# EAGLE design working (EAGLE 6.4)
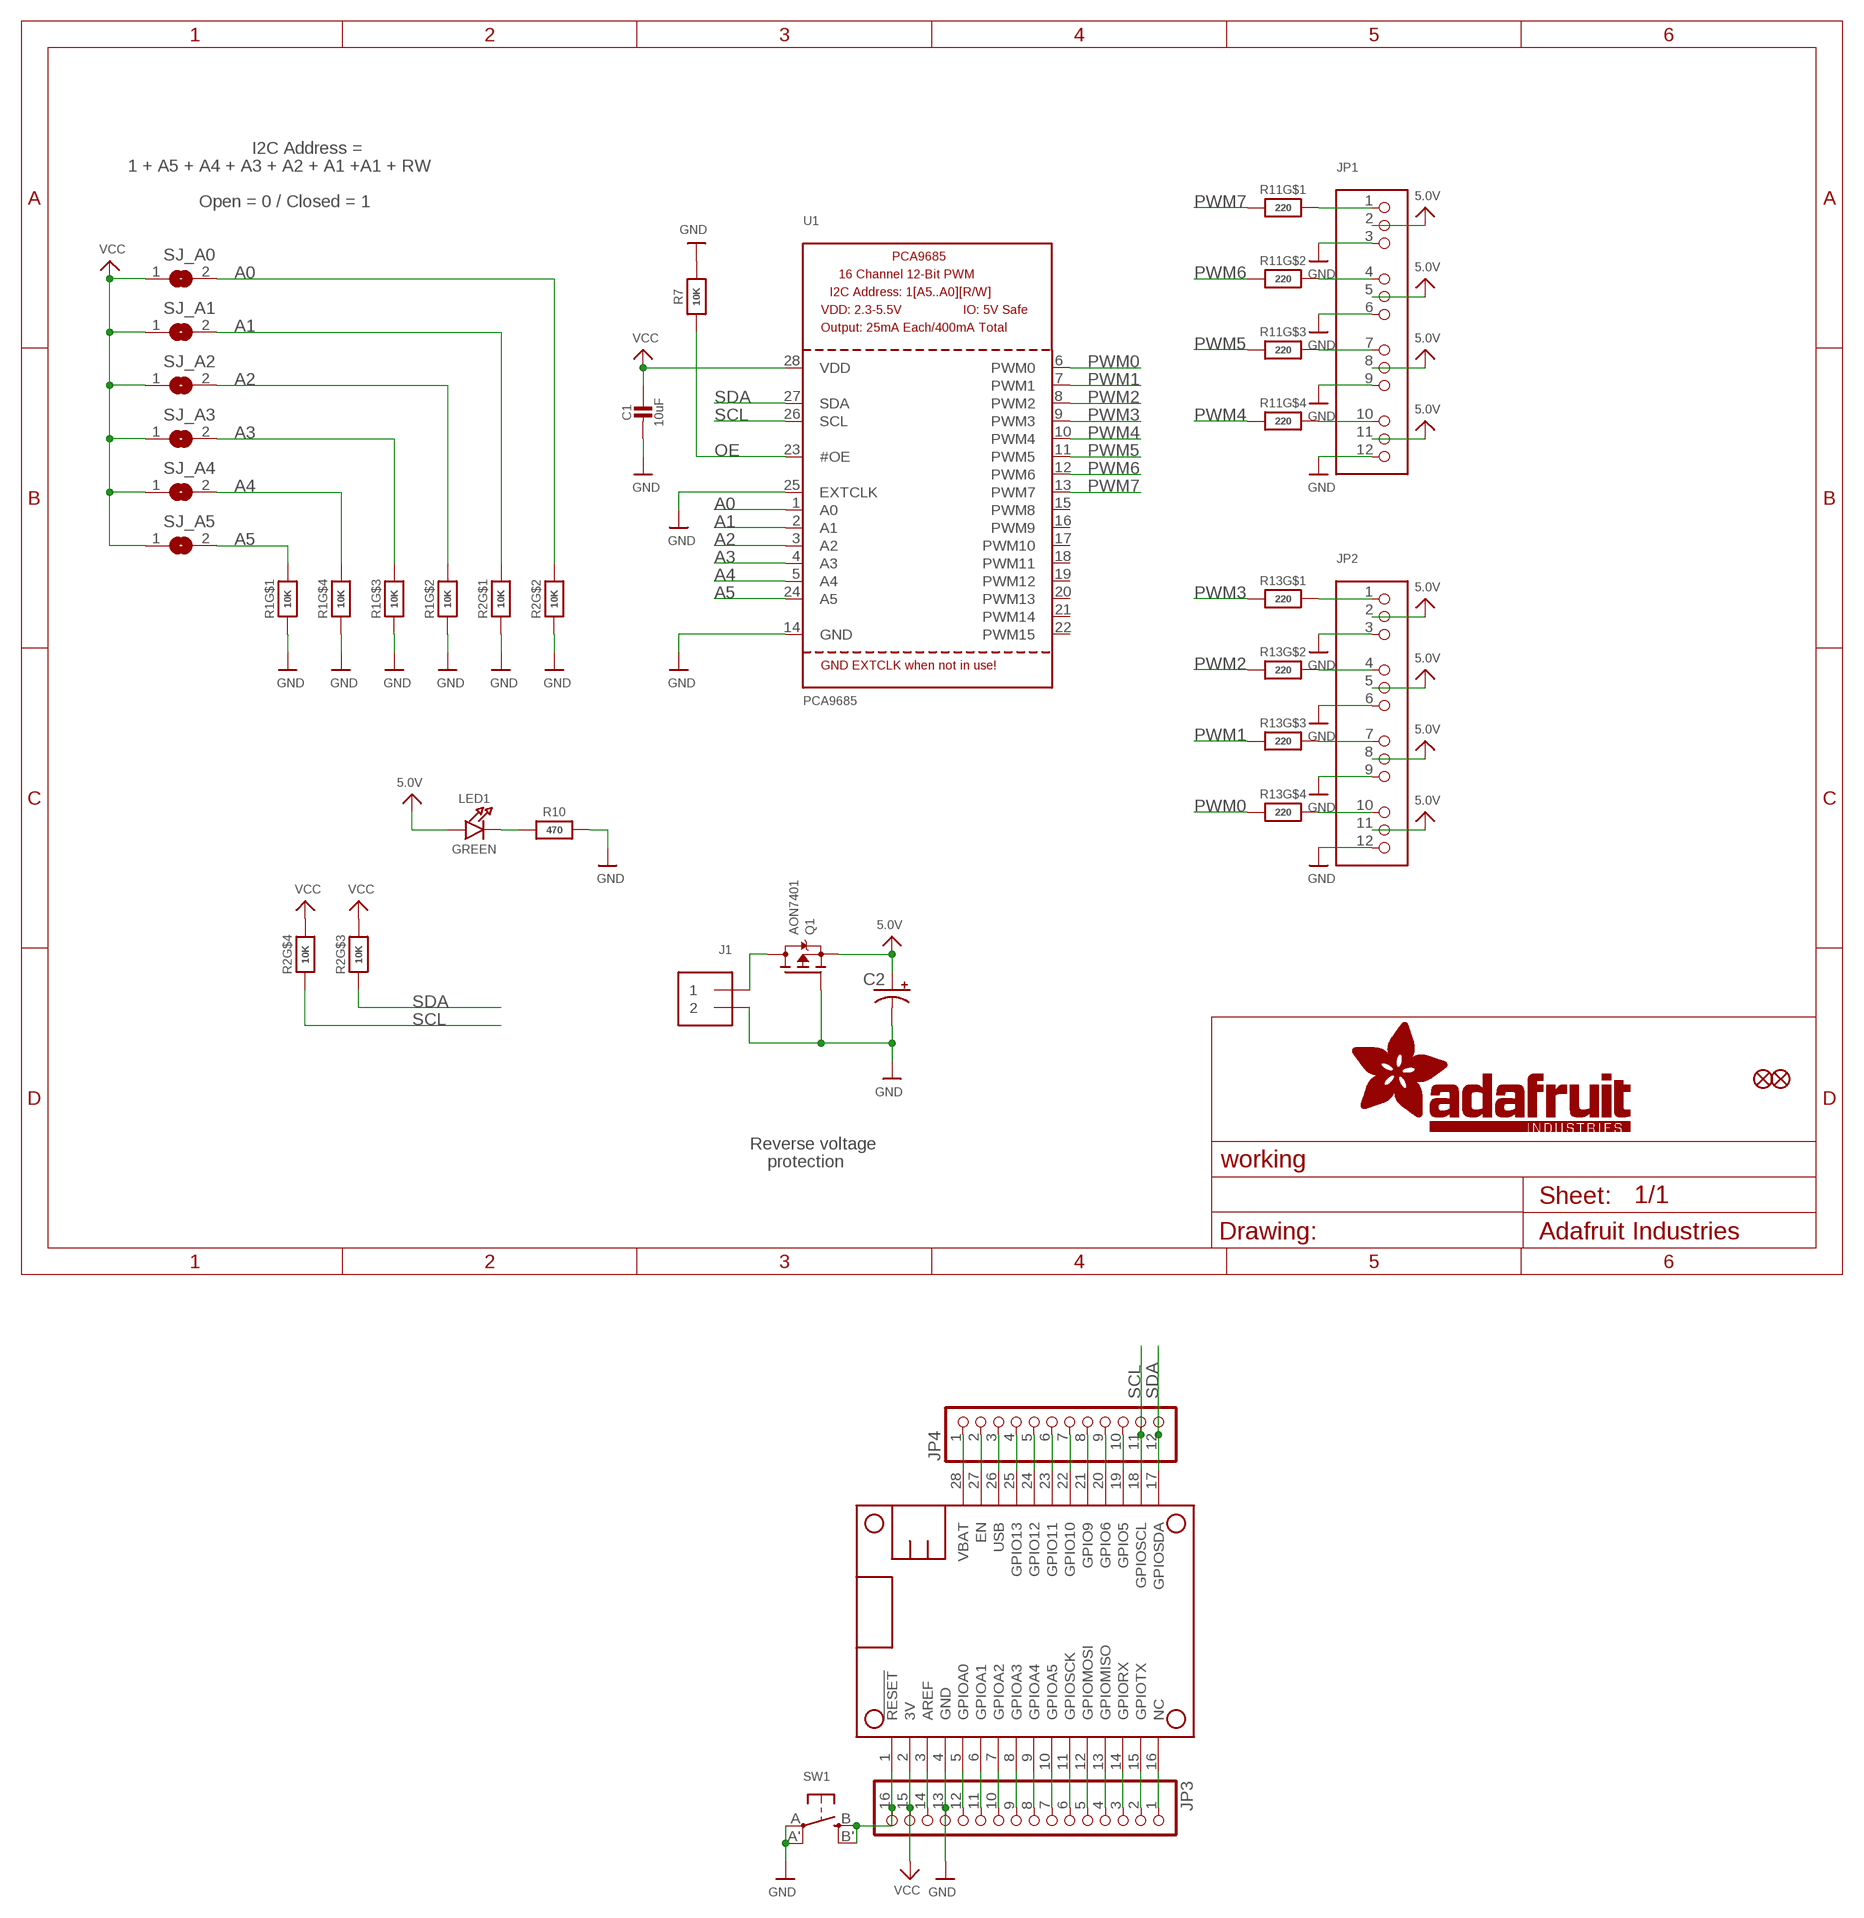
[diagram p0: schematic, sheet 1]

## Parts
C1  10uF  CAP_CERAMIC0805-NOOUTLINE  [0805-NO]
C2  CPOL-USE3.5-8  [E3,5-8]
FID1  FIDUCIAL""  [FIDUCIAL_1MM]
FID2  FIDUCIAL""  [FIDUCIAL_1MM]
J1  TERMBLOCK_1X2  [TERMBLOCK_1X2-3.5MM]
JP1  HEADER-3X04  [3X04]
JP2  HEADER-3X04  [3X04]
JP3  HEADER-1X16ROUND  [1X16_ROUND]
JP4  HEADER-1X12  [1X12_ROUND]
LED1  GREEN  LED0805_NOOUTLINE  [CHIPLED_0805_NOOUTLINE]
MS1  FEATHERWING  [FEATHERWING]
Q1  AON7401  MOSFET-P-POWERDI3333  [POWERDI3333]
R1  10K  RESISTOR_4PACK  [RESPACK_4X0603]
R2  10K  RESISTOR_4PACK  [RESPACK_4X0603]
R7  10K  RESISTOR0805_NOOUTLINE  [0805-NO]
R10  470  RESISTOR0805_NOOUTLINE  [0805-NO]
R11  220  RESISTOR_4PACK  [RESPACK_4X0603]
R13  220  RESISTOR_4PACK  [RESPACK_4X0603]
SJ_A0  SOLDERJUMPERREFLOW_NOPASTE  [SOLDERJUMPER_REFLOW_NOPASTE]
SJ_A1  SOLDERJUMPERREFLOW_NOPASTE  [SOLDERJUMPER_REFLOW_NOPASTE]
SJ_A2  SOLDERJUMPERREFLOW_NOPASTE  [SOLDERJUMPER_REFLOW_NOPASTE]
SJ_A3  SOLDERJUMPERREFLOW_NOPASTE  [SOLDERJUMPER_REFLOW_NOPASTE]
SJ_A4  SOLDERJUMPERREFLOW_NOPASTE  [SOLDERJUMPER_REFLOW_NOPASTE]
SJ_A5  SOLDERJUMPERREFLOW_NOPASTE  [SOLDERJUMPER_REFLOW_NOPASTE]
SW1  SWITCH_TACT_SMT4.6X2.8  [BTN_KMR2_4.6X2.8]
U1  PCA9685  [TSSOP28]

## Nets
5.0V: C2.+ JP1.2 JP1.5 JP1.8 JP1.11 JP2.2 JP2.5 JP2.8 JP2.11 LED1.A Q1.1(S) Q1.2(S) Q1.3(S)
A0: R2.7 SJ_A0.2 U1.1(A0)
A1: R2.8 SJ_A1.2 U1.2(A1)
A2: R1.7 SJ_A2.2 U1.3(A2)
A3: R1.6 SJ_A3.2 U1.4(A3)
A4: R1.5 SJ_A4.2 U1.5(A4)
A5: R1.8 SJ_A5.2 U1.24(A5)
GND: C1.2 C2.- J1.2 JP1.3 JP1.6 JP1.9 JP1.12 JP2.3 JP2.6 JP2.9 JP2.12 JP3.13 MS1.4(GND) Q1.4(G) R1.1 R1.2 R1.3 R1.4 R2.1 R2.2 R7.2 R10.2 SW1.A'(P1) SW1.A(P) U1.14(GND) U1.25(EXTCLK)
N$1: LED1.C R10.1
N$2: JP1.4 R11.7
N$3: JP1.1 R11.8
N$4: JP1.7 R11.6
N$5: JP1.10 R11.5
N$6: JP2.1 R13.8
N$7: JP2.4 R13.7
N$8: JP2.7 R13.6
N$9: JP2.10 R13.5
N$10: JP3.1 MS1.16(NC)
N$11: JP3.2 MS1.15(GPIOTX)
N$12: JP3.3 MS1.14(GPIORX)
N$13: JP3.4 MS1.13(GPIOMISO)
N$14: JP3.5 MS1.12(GPIOMOSI)
N$15: JP3.6 MS1.11(GPIOSCK)
N$16: JP3.7 MS1.10(GPIOA5)
N$17: JP3.8 MS1.9(GPIOA4)
N$18: JP3.9 MS1.8(GPIOA3)
N$19: JP3.10 MS1.7(GPIOA2)
N$20: JP3.11 MS1.6(GPIOA1)
N$21: JP3.12 MS1.5(GPIOA0)
N$22: JP3.14 MS1.3(AREF)
N$24: JP4.2 MS1.27(EN)
N$25: JP4.4 MS1.25(GPIO13)
N$26: JP4.5 MS1.24(GPIO12)
N$27: JP4.6 MS1.23(GPIO11)
N$28: JP4.7 MS1.22(GPIO10)
N$29: JP4.8 MS1.21(GPIO9)
N$30: JP4.9 MS1.20(GPIO6)
N$31: JP4.10 MS1.19(GPIO5)
N$32: JP3.16 MS1.1(!RESET) SW1.B'(S1) SW1.B(S)
OE: R7.1 U1.23(#OE)
PWM0: R13.4 U1.6(PWM0)
PWM1: R13.3 U1.7(PWM1)
PWM2: R13.2 U1.8(PWM2)
PWM3: R13.1 U1.9(PWM3)
PWM4: R11.4 U1.10(PWM4)
PWM5: R11.3 U1.11(PWM5)
PWM6: R11.2 U1.12(PWM6)
PWM7: R11.1 U1.13(PWM7)
PWRIN: J1.1 Q1.5678(D)
SCL: JP4.11 MS1.18(GPIOSCL) R2.4 U1.26(SCL)
SDA: JP4.12 MS1.17(GPIOSDA) R2.3 U1.27(SDA)
USB: JP4.3 MS1.26(USB)
VBAT: JP4.1 MS1.28(VBAT)
VCC: C1.1 JP3.15 MS1.2(3V) R2.5 R2.6 SJ_A0.1 SJ_A1.1 SJ_A2.1 SJ_A3.1 SJ_A4.1 SJ_A5.1 U1.28(VDD)
Unconnected: U1.15(PWM8) U1.16(PWM9) U1.17(PWM10) U1.18(PWM11) U1.19(PWM12) U1.20(PWM13) U1.21(PWM14) U1.22(PWM15)

## Notes on the sheet
- I2C Address =
- 1 + A5 + A4 + A3 + A2 + A1 +A1 + RW
- Open = 0 / Closed = 1
- Reverse voltage
- protection

## Library data of the parts
C1 = microbuilder:CAP_CERAMIC: Ceramic Capacitors For new designs, use the packages preceded by an '_' character since they are more reliable: The following footprints should be used on most boards: _0402 - Standard footprint for regular board layouts _0603 - Standard footprint for regular board layouts _0805 - Standard footprint for regular board layouts _1206 - Standard footprint for regular board layouts For extremely tight-pitch boards where space is at a premium, the following 'micro-pitch' footprints can be used (smaller pads, no silkscreen outline, etc.): _0402MP - Micro-pitch footprint for very dense/compact boards _0603MP - Micro-pitch footprint for very dense/compact boards _0805MP - Micro-pitch footprint for very dense/compact boards _1206MP - Micro-pitch footprint for very dense/compact boards
C2 = adafruit:CPOL-US: POLARIZED CAPACITOR, American symbol
FID1 FID2 = microbuilder:FIDUCIAL: Fiducial Alignment Points Various fiducial points for machine vision alignment.; BOM: EXCLUDE
J1 = microbuilder:TERMBLOCK_1X2: 3.5mm Terminal block http://www.ladyada.net/library/pcb/eaglelibrary.html
JP1 JP2 = microbuilder:HEADER-3X04
JP3 = microbuilder:HEADER-1X16: PIN HEADER
JP4 = microbuilder:HEADER-1X12
LED1 = microbuilder:LED: LED 0603 - 0603 Surface Mount Package 2mA: Green LED - Low Power (3.9mcd, 2ma, 1.7Vf) - Digikey: 475-2709-2-ND Orange LED - Low Power (9.8mcd, 2ma, 1.8Vf) - Digikey: 475-1194-2-ND Red LED - Low Power (5mcd, 2ma, 1.8Vf) - Digikey: 475-1195-2-ND Yellow LED - Low Power (7mcd, 2ma, 1.8Vf) - Digikey: 475-1196-2-ND 5mA: Blue LED - Low Power (17mcd, 5ma, 2.9Vf) - Digikey: LNJ937W8CRACT-ND 0805 - 0805 Surface Mount Package 2mA: Red LED (8.8mcd, 2mA, 1.8Vf, Clear) - Low Power [Digikey: 475-2510-1-ND] Green LED (5mcd, 2mA, 1.8Vf, Clear) - Low Power [Digikey: 475-2730-1-ND] Yellow LED (11.3mcd, 2mA, 1.8Vf, Clear) - Low Power [Digikey: 475-2555-1-ND] 20mA: Red LED (104mcd, 20mA, Diffused) - LS R976 [Digikey: 475-1278-6-ND] Red LED (12mcd, 20mA, 2.0Vf, Clear) - APT2012EC [Digikey: 754-1128-1-ND] Green LED (15mcd, 20mA, 2.2Vf, Clear) - APT2012GC [Digikey: 754-1131-1-ND] Orange LED (160mcd, 20mA, 2.1Vf, Clear) - APT2012SECK [Digikey: 754-1130-1-ND] 1206 - 1206 Surface Mount Package Green LED (26mcd, 20mA, Diffused) - LG N971 [Digikey: 475-1407-6-ND] Red LED (15mcd, 20mA, Diffused) - LH N974 [Digikey: 475-1416-6-ND] Cree - Cree High-Power Surface Mount LEDs XPEBWT-L1-0000-00D50 - White 111lm 350mA 2.9Vf 6200K 110° XTEAWT-00-0000-00000LEE3 - White 114lm 350mA 2.85Vf 5000K 115° Everlight - Everlight 45-21 Series Surface Mount LEDs 45-21/QK2C-B2832AC2CB2/2T - Warm White 2000mcd 20mA 3.25Vf 3050K 120° 45-21/LK2C-B38452C4CB2/2T - Nuetral White 2000mcd 20mA 3.25Vf 4150K 120° 45-21/LK2C-B50634C6CB2/2T - Cold White 2200mcd 20mA 3.25Vf 5650K 120° PLCC2 Reverse Mount LS T77K-J1L2-1-0-2-R18-Z - Red 11.25mcd 2mA 1.8Vf 630nm 120° LO T77K-L1M2-24-Z - Orange 19.6mcd 2mA 1.8Vf 606nm 120° LY T77K-K2M1-26-Z - Yellow 15.7mcd 2mA 1.8Vf 587nm 120°
MS1 = microbuilder:FEATHERWING
Q1 = microbuilder:MOSFET-P: P-Channel Mosfet LEGEND VDS: Voltage Drain-Source ID: Drain Current RDS(ON): Drain-Source On-State Resistance VGS(TH): Gate-Source Threshold Voltage CISS: Drain-Source Input Capacitance SOT-23 Name VDS ID RDS(ON) VGS(TH) CISS Order Number IRLML5103 30V 760mA 600 mOhm -- 75pF @ 25V Digikey: IRLML5103PBFCT-ND IRLML6401 12V 4.3A 50 mOhm 950mV @ 250µA 830pF @ 10V Digikey: IRLML6401PBFTR-ND NTR0202PL 20V 400mA 800 mOhm 2.3V @ 250uA 70pF @ 5V Digikey: NTR0202PLT1GOSTR-ND NTR4101PT1G 20V 1.8A 85 mOhm 1.2V @ 250uA 675pF @ 10V Digikey: NTR4101PT1GOSCT-ND DMP2004K 20V 600mA 900 mOhm 1V @ 250uA 175pF @ 16V Digikey: DMP2004KDICT-ND PMV65XP 20V 3.9A 76 mOhm 950mV @ 1mA 725pF @ 20V Digikey: 568-2358-2-ND TO-252 Name VDS ID RDS(ON) VGS(TH) CISS Order Number AOD417 30V 25A 34 mOhm 3V @ 250µA 920pF @ 15V Digikey: 785-1106-2-ND
R1 R2 R11 R13 = microbuilder:RESISTOR_4PACK: Resistor Packs (4 resistors) 4 x 0603 10K 1/16W - Digikey: YC164J-10KCT-ND
R7 R10 = microbuilder:RESISTOR: Resistors For new designs, use the packages preceded by an '_' character since they are more reliable: The following footprints should be used on most boards: _0402 - Standard footprint for regular board layouts _0603 - Standard footprint for regular board layouts _0805 - Standard footprint for regular board layouts _1206 - Standard footprint for regular board layouts For extremely tight-pitch boards where space is at a premium, the following 'micro-pitch' footprints can be used (smaller pads, no silkscreen outline, etc.): _0402MP - Micro-pitch footprint for very dense/compact boards _0603MP - Micro-pitch footprint for very dense/compact boards _0805MP - Micro-pitch footprint for very dense/compact boards _1206MP - Micro-pitch footprint for very dense/compact boards
SJ_A0 SJ_A1-SJ_A5 = microbuilder:SOLDERJUMPER: SMD Solder JUMPER Solder the two pads together to create a connection, or remove the solder to break it. REFLOW - Use this footprint for solder paste and reflow ovens. WAVE - Use this footprint for hand-soldering (larger pads). CLOSED - Has a trace between the two pads to ensure it is closed by default. The trace needs to be cut to disable the jumper, and can be closed again by creating a solder bridge between the two pads.
SW1 = microbuilder:SWITCH_TACT_SMT: SMT Tact Switches 6x6mm - Digikey: P12940SCT-ND KMR2 (4.6x2.8mm) - Digikey: 401-1426-1-ND EVQ-PQHB55 - Light Touch, 160GF (4.5x4.5mm) - Digikey: P8090SCT-ND KMT0 - KMT021 NGJ LHS (etc.) IP68/Waterproof - Digikey: CKN10289CT-ND
U1 = microbuilder:PCA9685: PCA9685 - 16 Channel 12-Bit I2C PWM Controller 5.0V tolerant 16 channel, 12-bit I2C PWM controller with 25mA per output (max. 400mA total) Digikey: 568-5931-1-ND

## Board
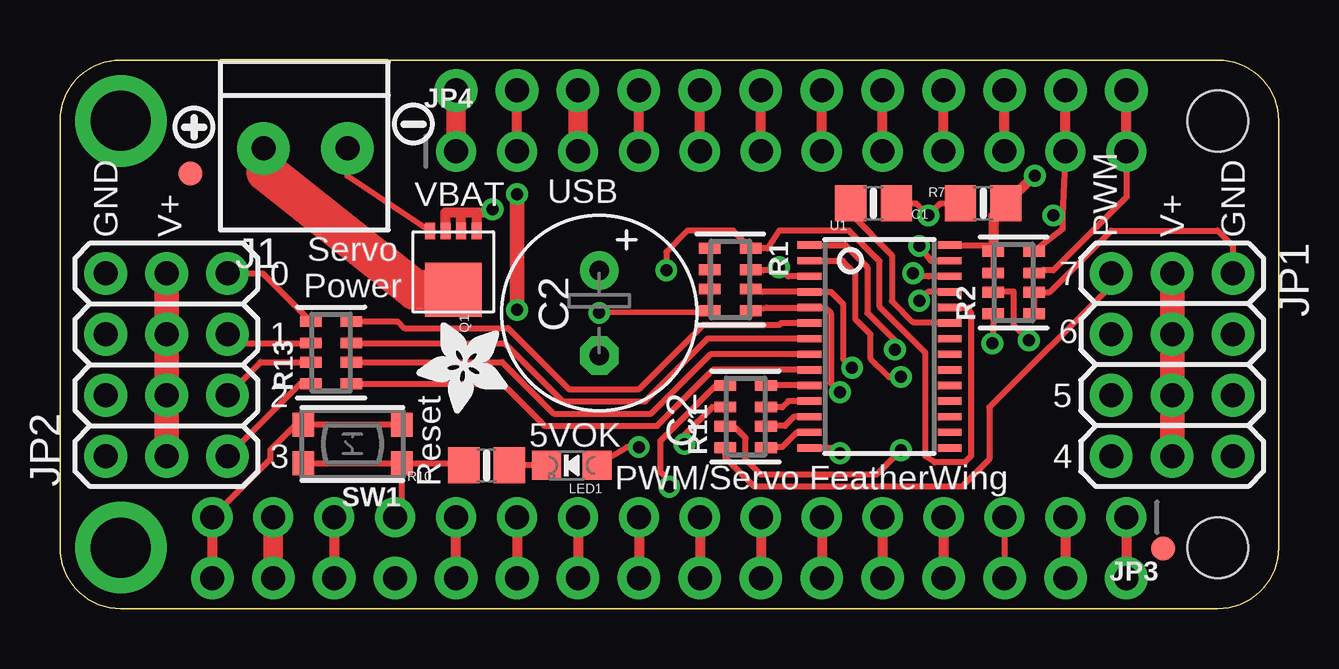
[diagram p1: board, top side]
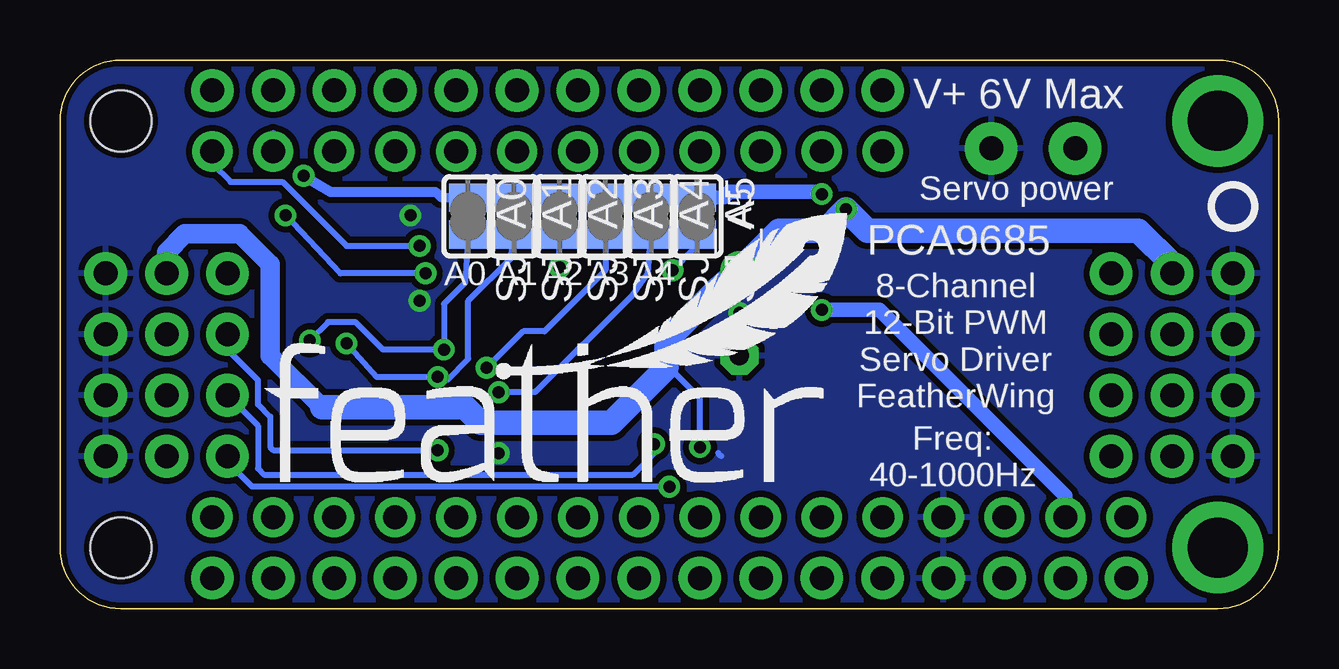
[diagram p2: board, bottom side, seen from below]

Size 50.8 x 22.86 mm. Coordinates in mm from the lower left corner, seen from the top.
Outline: 2.54,22.86 48.26,22.86 arc-90 50.8,20.32 50.8,2.54 arc-90 48.26,0 2.54,0 arc-90 0,2.54 0,20.32 arc-90 2.54,22.86
Copper layers (1*16): Top 0.035mm / dielectric 1.5mm / Bottom 0.035mm
Design rules "adafruit": minimum track width 8mil, minimum drill 15.5mil, track to track 8mil, track to pad 8mil, pad to pad 8mil, via to via 8mil, smd to smd 8mil, copper to edge 10mil, drill to drill 8mil, minimum pad ring 10mil, minimum via ring 8mil, stop-mask expansion 2mil, vias tented up to drill 20mil, thermal gap 10mil

### Footprints (pad centres in the part's own frame; a part is rotated, then mirrored left to right if it is on the bottom)
0805-NO = smd 1.3 x 1.5: 1 -0.95,0; 2 0.95,0
E3,5-8 = drill 0.813 pad 1.6: + -1.778,0 | drill 0.813 pad 1.6 octagon: - 1.778,0
FIDUCIAL_1MM = smd 1 x 1: 1 0,0
TERMBLOCK_1X2-3.5MM = drill 1 pad 2.184: 1 1.8,0; 2 -1.7,0
3X04 = drill 1 pad 1.778: 1 -3.81,-2.54; 2 -3.81,0; 3 -3.81,2.54; 4 -1.27,-2.54; 5 -1.27,0; 6 -1.27,2.54; 7 1.27,-2.54; 8 1.27,0; 9 1.27,2.54; 10 3.81,-2.54; 11 3.81,0; 12 3.81,2.54
1X16_ROUND = drill 1 pad 1.676: 1 -19.05,0; 2 -16.51,0; 3 -13.97,0; 4 -11.43,0; 5 -8.89,0; 6 -6.35,0; 7 -3.81,0; 8 -1.27,0; 9 1.27,0; 10 3.81,0; 11 6.35,0; 12 8.89,0; 13 11.43,0; 14 13.97,0; 15 16.51,0; 16 19.05,0
1X12_ROUND = drill 1 pad 1.676: 1 -13.97,0; 2 -11.43,0; 3 -8.89,0; 4 -6.35,0; 5 -3.81,0; 6 -1.27,0; 7 1.27,0; 8 3.81,0; 9 6.35,0; 10 8.89,0; 11 11.43,0; 12 13.97,0
CHIPLED_0805_NOOUTLINE = smd 1.2 x 1.2: A 0,-1.05; C 0,1.05
FEATHERWING = drill 1 pad 1.778: 1 6.35,1.27; 2 8.89,1.27; 3 11.43,1.27; 4 13.97,1.27; 5 16.51,1.27; 6 19.05,1.27; 7 21.59,1.27; 8 24.13,1.27; 9 26.67,1.27; 10 29.21,1.27; 11 31.75,1.27; 12 34.29,1.27; 13 36.83,1.27; 14 39.37,1.27; 15 41.91,1.27; 16 44.45,1.27; 17 44.45,21.59; 18 41.91,21.59; 19 39.37,21.59; 20 36.83,21.59; 21 34.29,21.59; 22 31.75,21.59; 23 29.21,21.59; 24 26.67,21.59; 25 24.13,21.59; 26 21.59,21.59; 27 19.05,21.59; 28 16.51,21.59 | drill 2.5 pad 3.81: P$1 2.54,20.32; P$2 2.54,2.54 | hole 2.54: 48.26,20.32; 48.26,2.54
POWERDI3333 = smd 0.7 x 0.42: 1 -1.7,0.975; 2 -1.7,0.325; 3 -1.7,-0.325; 4 -1.7,-0.975 | smd 2.25 x 2.35: 5678 0.75,0
RESPACK_4X0603 = smd 0.45 x 0.9: 1 -1.3,-0.85; 2 -0.4,-0.85; 3 0.4,-0.85; 4 1.3,-0.85; 5 1.3,0.85; 6 0.4,0.85; 7 -0.4,0.85; 8 -1.3,0.85
SOLDERJUMPER_REFLOW_NOPASTE = smd 1.168 x 1.6: 1 -0.762,0; 2 0.762,0
BTN_KMR2_4.6X2.8 = smd 0.9 x 1: A 2.05,0.8; A' -2.05,0.8; B 2.05,-0.8; B' -2.05,-0.8
TSSOP28 = smd 0.305 x 0.991: 1 -4.225,-2.918; 2 -3.575,-2.918; 3 -2.925,-2.918; 4 -2.275,-2.918; 5 -1.625,-2.918; 6 -0.975,-2.918; 7 -0.325,-2.918; 8 0.325,-2.918; 9 0.975,-2.918; 10 1.625,-2.918; 11 2.275,-2.918; 12 2.925,-2.918; 13 3.575,-2.918; 14 4.225,-2.918; 15 4.225,2.918; 16 3.575,2.918; 17 2.925,2.918; 18 2.275,2.918; 19 1.625,2.918; 20 0.975,2.918; 21 0.325,2.918; 22 -0.325,2.918; 23 -0.975,2.918; 24 -1.625,2.918; 25 -2.275,2.918; 26 -2.925,2.918; 27 -3.575,2.918; 28 -4.225,2.918

### Placement (x,y rotation side)
C1  38.48,16.89 180 top
C2  22.48,12.32 270 top
FID1  5.45,18.13 0 top
FID2  45.97,2.51 0 top
J1  10.29,19.18 180 top
JP1  46.35,10.16 270 top
JP2  4.45,10.16 90 top
JP3  25.4,3.81 180 top
JP4  30.48,19.05 0 top
LED1  21.34,5.97 90 top
MS1  0,0 0 top
Q1  16.4,14.04 270 top
R1  27.94,13.72 270 top
R2  39.75,13.59 90 top
R7  33.91,16.89 0 top
R10  17.78,5.97 180 top
R11  28.57,8 90 top
R13  11.3,10.67 90 top
SJ_A0  33.78,16.35 270 bottom
SJ_A1  31.88,16.35 270 bottom
SJ_A2  29.97,16.35 270 bottom
SJ_A3  28.07,16.35 270 bottom
SJ_A4  26.16,16.35 270 bottom
SJ_A5  24.26,16.35 270 bottom
SW1  12.19,6.86 180 top
U1  34.16,10.92 270 top
U$11  [SYMBOL_PLUS]  5.59,20.07 0 top
U$12  [SYMBOL_MINUS]  14.73,20.19 0 top
U$14  [ADAFRUIT_3.5MM]  18.67,11.94 180 top
U$15  [FEATHERLOGO]  42.29,5.21 0 bottom
U$16  [PCBFEAT-REV-040]  1.91,16.76 0 bottom

### Tracks (layer width: path | path; a pad name or v marks a point on that pad's centre or on a via)
5.0V  (via drill 0.5)
  Top 0.254: v24.13,6.73 23.66,6.73 LED1.A
  Top 0.406: Q1.3 16.07,16.51 16.72,16.51 | 16.72,16.51 17.37,16.51 | 17.37,16.51 Q1.1 | Q1.2 16.72,16.51 | 17.37,16.51 17.78,16.51 v18.03,16.64
  Top 1.016: JP2.11 JP2.8 JP2.5 JP2.2 | JP1.2 JP1.5 JP1.8 JP1.11
  Bottom 0.254: 22.73,14.1 C2.+ | v24.13,6.73 24.13,8.76 25.53,10.16
  Bottom 0.813: JP2.11 4.45,14.35 | 39.88,8.38 42.04,10.54 42.04,14.35 43.31,15.62 45.59,15.62 46.35,14.86 JP1.2
  Bottom 1.016: 4.45,14.35 5.84,15.75 17.14,15.75 v18.03,16.64 18.92,15.75 20.83,15.75 C2.+ 23.37,13.34 25.53,11.18 25.53,10.16 25.53,10.03 27.81,7.75 33.27,7.75 33.91,8.38 39.88,8.38
A0  (via drill 0.5)
  Top 0.254: U1.1 32.73,15.15 33.66,14.22 33.66,12.32 34.8,11.18 v34.8,10.79 | v40.39,11.18 39.75,11.81 39.75,13.21 39.26,13.21 R2.7
  Bottom 0.254: v40.39,11.18 39.62,11.94 38.48,11.94 37.34,10.79 v34.8,10.79 34.8,12.7 33.91,13.59 SJ_A0.2
A1  (via drill 0.5)
  Top 0.254: R2.8 38.9,12.1 v38.86,11.05 | v35.05,9.65 34.54,9.65 33.78,10.41 33.78,11.43 33.15,12.06 33.15,13.97 32.64,14.48 31.26,14.48 U1.2
  Bottom 0.254: v38.86,11.05 37.59,9.65 v35.05,9.65 34.67,9.53 33.78,10.41 33.78,12.83 32,14.61 SJ_A1.2
A2  (via drill 0.5)
  Top 0.254: U1.3 30.35,13.85 30.1,14.1 | 30.1,14.1 29.32,14.1 R1.7 | 30.1,14.1 v29.97,14.22
  Bottom 0.254: v29.97,14.22 SJ_A2.2
A3  (via drill 0.5)
  Top 0.254: R1.6 29.3,13.2 U1.4 32.14,13.2 32.64,12.7 32.64,10.41 v33.02,10.03
  Bottom 0.254: SJ_A3.2 28.07,14.1 30.61,11.56 31.5,11.56 v33.02,10.03
A4  (via drill 0.5)
  Top 0.254: R1.5 29.43,12.55 U1.5 31.9,12.55 32.13,12.32 32.13,9.4 v32.51,9.02
  Bottom 0.254: SJ_A4.2 26.29,13.97 26.92,13.08 30.99,9.02 v32.51,9.02
A5  (via drill 0.5)
  Top 0.254: U1.24 37.87,12.55 37.97,12.32 37.97,6.35 37.72,6.1 36.45,6.1 36.07,6.35 36.07,10.67 34.16,12.57 34.16,14.48 32.89,15.75 29.97,15.75 29.49,15.02 R1.8 28.06,15.75 26.16,15.75 25.27,14.86 v25.27,14.1
  Bottom 0.254: v25.27,14.1 24.38,14.99 SJ_A5.2
GND  (via drill 0.5)
  Top 0.254: R1.3 R1.2 R1.1 R1.3 | R1.3 R1.4 27.09,12.36 v22.48,12.32 | U1.14 32.35,6.7 v32.51,6.48 | R7.2 35.69,16.89 v36.2,16.38 36.7,16.89 C1.2 | R2.1 R2.2 41.26,13.19 43.81,15.75 48.26,15.75 48.9,15.11 JP1.3 | U1.25 36.18,13.2 v35.81,12.83 | Q1.4 11.99,18.03 J1.2 | SW1.A SW1.A' | SW1.A' 16.92,6.06 R10.2 | SW1.A' 14.24,4.08 JP3.13
  Bottom 0.254: v22.48,12.32 22.61,12.32 | 23.24,6.35 23.37,6.48 | v35.81,12.83 35.81,13.08
  pour Bottom (isolate 0.254): 0,0 0,22.89 50.97,23.14 50.97,0
N$1
  Top 0.254: LED1.C R10.1
N$2  (via drill 0.5)
  Top 0.254: v35.05,6.6 34.04,5.59 29.21,5.59 28.57,6.22 28.57,7.11 28.09,7.6 R11.7
  Bottom 0.254: v35.05,6.6 41.91,6.6 42.04,6.73 42.04,8 42.55,8.51 42.55,9.53 43.81,10.79 JP1.4
N$3
  Top 0.254: R11.8 27.73,6.31 28.96,5.08 37.59,5.08 38.73,6.22 38.73,8.38 43.81,13.46 JP1.1
N$4  (via drill 0.5)
  Top 0.254: R11.6 27.2,8.4 26.04,7.24 v26.04,6.86
  Bottom 0.254: JP1.7 42.55,7.62 42.55,5.84 42.29,5.59 26.92,5.59 26.04,6.48 v26.04,6.86
N$5  (via drill 0.5)
  Top 0.254: R11.5 27.34,9.3 25.02,6.99 25.02,5.71 25.4,5.33 v25.4,5.08
  Bottom 0.254: v25.4,5.08 42.8,5.08 43.81,6.1 JP1.10
N$6
  Top 0.254: JP2.1 10,9.37 R13.8
N$7
  Top 0.254: JP2.4 8.36,10.27 R13.7
N$8
  Top 0.254: JP2.7 7.35,11.07 R13.6
N$9
  Top 0.254: JP2.10 8.45,13.97 R13.5
N$10
  Top 0.406: JP3.1 MS1.16
N$11
  Top 0.406: JP3.2 MS1.15
N$12
  Top 0.254: JP3.3 MS1.14
N$13
  Top 0.406: JP3.4 MS1.13
N$14
  Top 0.406: JP3.5 MS1.12
N$15
  Top 0.406: JP3.6 MS1.11
N$16
  Top 0.406: JP3.7 MS1.10
N$17
  Top 0.406: JP3.8 MS1.9
N$18
  Top 0.406: JP3.9 MS1.8
N$19
  Top 0.406: JP3.10 MS1.7
N$20
  Top 0.406: JP3.11 MS1.6
N$21
  Top 0.406: MS1.5 JP3.12
N$22
  Top 0.406: JP3.14 MS1.3
N$24
  Top 0.406: JP4.2 MS1.27
N$25
  Top 0.406: JP4.4 MS1.25
N$26
  Top 0.406: JP4.5 MS1.24
N$27
  Top 0.406: JP4.6 MS1.23
N$28
  Top 0.406: JP4.7 MS1.22
N$29
  Top 0.406: JP4.8 MS1.21
N$30
  Top 0.406: JP4.9 MS1.20
N$31
  Top 0.406: JP4.10 MS1.19
N$32
  Top 0.254: SW1.B' SW1.B 9.82,7.66 8.76,6.6 8.76,6.22 JP3.16
  Top 0.406: JP3.16 MS1.1
OE
  Top 0.254: R7.1 32.96,16.44 34.67,14.73 34.67,12.83 35.56,11.94 37.04,11.94 U1.23
PWM0
  Top 0.254: U1.6 30.06,11.9 29.97,11.81 26.8,11.81 24.13,9.14 21.21,9.14 18.67,11.68 14.35,11.68 14.07,11.97 R13.4
PWM1
  Top 0.254: U1.7 27,11.25 24.38,8.64 20.95,8.64 18.52,11.07 R13.3
PWM2
  Top 0.254: U1.8 27.11,10.6 24.64,8.13 20.57,8.13 18.43,10.27 R13.2
PWM3
  Top 0.254: U1.9 27.22,9.95 24.89,7.62 20.19,7.62 18.45,9.37 R13.1
PWM4
  Top 0.254: U1.10 R11.4
PWM5
  Top 0.254: U1.11 30.36,8.65 30.1,8.38 29.44,8.38 R11.3
PWM6
  Top 0.254: U1.12 30.6,8 30.23,7.62 29.44,7.62 R11.2
PWM7
  Top 0.254: U1.13 30.71,7.35 30.1,6.73 29.45,6.73 R11.1
PWRIN
  Top 1.676: J1.1 8.61,18.18 14.78,13.29 Q1.5678
SCL  (via drill 0.5)
  Top 0.254: JP4.11 41.78,16.38 | 41.78,16.38 41.78,15.82 R2.4 | U1.26 36.2,13.85 35.69,13.84 v35.56,13.97 | v41.4,16.38 41.78,16.38
  Top 0.406: JP4.11 MS1.18
  Bottom 0.254: 41.91,19.81 JP4.11 | v35.56,13.97 39.12,13.97 v41.4,16.38
SDA  (via drill 0.5)
  Top 0.254: U1.27 37.08,14.48 36.32,14.48 v35.81,15.11 | JP4.12 44.45,17.14 41.4,14.1 40.96,14.1 R2.3
  Top 0.406: JP4.12 MS1.17
  Bottom 0.254: JP4.12 44.45,18.54 43.69,17.78 41.53,17.78 38.86,15.11 v35.81,15.11
USB
  Top 0.813: JP4.3 MS1.26
VBAT
  Top 0.813: JP4.1 MS1.28
VCC  (via drill 0.5)
  Top 0.254: U1.28 38.9,15.15 R2.5 R2.6
  Top 0.406: v40.64,18.03 C1.1 38.9,16.36 R2.5
  Top 0.61: v19.05,12.45 v19.05,17.27
  Top 0.813: MS1.2 JP3.15
  Bottom 0.406: v19.05,17.27 19.02,17.37 | v40.64,18.03 39.53,17.37 35.15,17.37 34.92,17.14 SJ_A0.1
  Bottom 0.61: SJ_A0.1 SJ_A1.1 SJ_A2.1 SJ_A3.1 SJ_A4.1 SJ_A5.1 23.11,17.14 22.89,17.37 19.02,17.37 | JP3.15 8.89,4.7 16.64,12.45 v19.05,12.45

### Text on the board
tPlace: VBAT | USB | GND | V+ | PWM | V+ | GND | Servo / Power | 0 | 7 | C2 | 6 | 1 | 2 | 5 | Reset | 5VOK | 3 | 4 | PWM/Servo FeatherWing
bPlace: V+ 6V Max | A5 | Servo power | PCA9685 | A4 | A3 | A2 | A1 | A0 | 8-Channel / 12-Bit PWM / Servo Driver / FeatherWing | Freq: / 40-1000Hz